# EAGLE schematic VoltammCircuit (EAGLE 7.1.0)
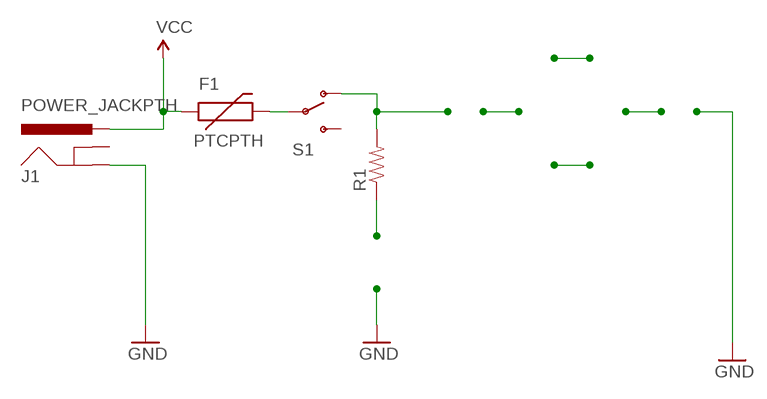
[diagram p0: schematic, sheet 1]

## Parts
F1  PTCPTH  [PTC]
J1  POWER_JACKPTH  [POWER_JACK_PTH]
R1  RESISTORAXIAL-0.3  [AXIAL-0.3]
S1  SWITCH-SPSTKIT  [SWITCH-SPDT_KIT]

## Nets
GND: J1.GND
N$1: F1.P$2 S1.2(P)
N$2: R1.P$1
N$3: R1.P$2 S1.1(O)
VCC: F1.P$1 J1.PWR
Unconnected: J1.GNDBREAK S1.3(S)

## Library data of the parts
F1 = SparkFun:PTC: Resettable Fuse PTC Resettable Fuse. Spark Fun Electronics SKU : COM-08357
J1 = SparkFun:POWER_JACK: Power Jack This is the standard 5.5mm barrel jack for power. The PTH is the most common, proven, reliable, footprint. All others are experimental. The Slot footprint only works if the mill layer is transmitted to the PCB fab house so be warned. Spark Fun Electronics SKU : PRT-00119. Mating wall wart : TOL-00298 (and others)
R1 = My Library:RESISTOR: Resistor Basic schematic elements and footprints for 0603, 1206, and PTH resistors.
S1 = SparkFun:SWITCH-SPST: SPST Switch Simple slide switch. Spark Fun Electronics SKU : COM-00102